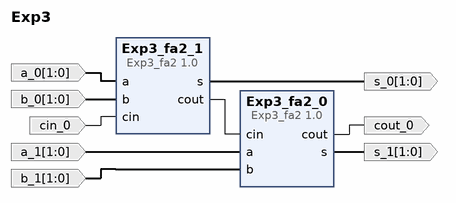
[diagram p0: block diagram of the top level]
# Vivado block design Exp3, xc7z020clg484-2, Vivado 2024.1
create_bd_design Exp3

create_bd_port -dir I -from 1 -to 0 a_0
create_bd_port -dir I -from 1 -to 0 b_0
create_bd_port -dir I cin_0
create_bd_port -dir O -from 1 -to 0 s_0
create_bd_port -dir I -from 1 -to 0 a_1
create_bd_port -dir I -from 1 -to 0 b_1
create_bd_port -dir O cout_0
create_bd_port -dir O -from 1 -to 0 s_1

create_bd_cell -type ip -vlnv xilinx.com:user:Exp3_fa2:1.0 Exp3_fa2_0
create_bd_cell -type ip -vlnv xilinx.com:user:Exp3_fa2:1.0 Exp3_fa2_1

# ---- connections ----

connect_bd_net [get_bd_pins Exp3_fa2_0/cout] [get_bd_ports cout_0]
connect_bd_net [get_bd_pins Exp3_fa2_0/s] [get_bd_ports s_1]
connect_bd_net [get_bd_pins Exp3_fa2_1/cout] [get_bd_pins Exp3_fa2_0/cin]
connect_bd_net [get_bd_pins Exp3_fa2_1/s] [get_bd_ports s_0]
connect_bd_net -net a_0_1 [get_bd_ports a_0] [get_bd_pins Exp3_fa2_1/a]
connect_bd_net -net a_1_1 [get_bd_ports a_1] [get_bd_pins Exp3_fa2_0/a]
connect_bd_net -net b_0_1 [get_bd_ports b_0] [get_bd_pins Exp3_fa2_1/b]
connect_bd_net -net b_1_1 [get_bd_ports b_1] [get_bd_pins Exp3_fa2_0/b]
connect_bd_net -net cin_0_1 [get_bd_ports cin_0] [get_bd_pins Exp3_fa2_1/cin]

validate_bd_design
save_bd_design
